# Altium schematic sheet efm8bb1-breakout.SchDoc
size Letter
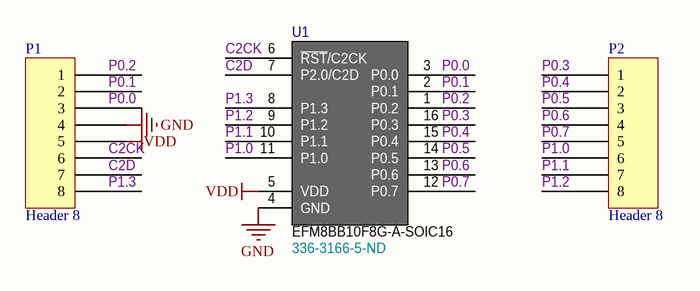
[diagram p0: efm8bb1-breakout.SchDoc]

## Parts
P1  Header 8  [HDR1X8-NOSILK-PINS]
P2  Header 8  [HDR1X8-NOSILK-PINS]
U1  EFM8BB10F8G-A-SOIC16  Supplier Part Number 1: 336-3166-5-ND  [SOIC127P600-16N]

## Nets
GND: P1.4 U1.4(GND)
VDD: P1.5 U1.5(VDD)
C2CK: P1.6 U1.6(~{RST}/C2CK)
C2D: P1.7 U1.7(P2.0/C2D)
P0.0: P1.3 U1.3(P0.0)
P0.1: P1.2 U1.2(P0.1)
P0.2: P1.1 U1.1(P0.2)
P0.3: P2.1 U1.16(P0.3)
P0.4: P2.2 U1.15(P0.4)
P0.5: P2.3 U1.14(P0.5)
P0.6: P2.4 U1.13(P0.6)
P0.7: P2.5 U1.12(P0.7)
P1.0: P2.6 U1.11(P1.0)
P1.1: P2.7 U1.10(P1.1)
P1.2: P2.8 U1.9(P1.2)
P1.3: P1.8 U1.8(P1.3)

## Library data of the parts
P1 P2 = Header 8: Header, 8-Pin; LatestRevisionDate: 17-Jul-2002; LatestRevisionNote: Re-released for DXP Platform.; Publisher: Altium Limited
U1 = EFM8BB10F8G-A-SOIC16: IC MCU 8BIT 8KB FLASH 16SOIC; Manufacturer: Silicon Labs; Core Size: 8-Bit; Speed: 25MHz; Connectivity: I²C, SMBus, SPI, UART/USART; Peripherals: Brown-out Detect/Reset, POR, PWM, WDT; Number of I/O: 13; Program Memory Size: 8KB (8K x 8); RAM Size: 512 x 8; Voltage - Supply (Vcc/Vdd): 2.2 V ~ 3.6 V; Data Converters: A/D 12x12b; Oscillator Type: Internal; Supplier 1: Digi-Key; Manufacturer Part Number: EFM8BB10F8G-A-SOIC16; RoHS: RoHS Compliant; Category: Integrated Circuits (ICs); Stock 1: 1222; Pricing 1: 1=0.59, 25=0.5372, 100=0.4883, 1000=0.43943 (USD); Packaging: Tube; Part Status: Active; Core Processor: CIP-51 8051; Program Memory Type: FLASH; EEPROM Size: -; Operating Temperature: -40°C ~ 85°C (TA); Package / Case: 16-SOIC (0.154", 3.90mm Width); Supplier Device Package: 16-SOIC; ComponentLink1URL: http://www.silabs.com/documents/public/data-sheets/efm8bb1-datasheet.pdf; ComponentLink1Description: http://www.silabs.com/documents/public/data-sheets/efm8bb1-datasheet.pdf